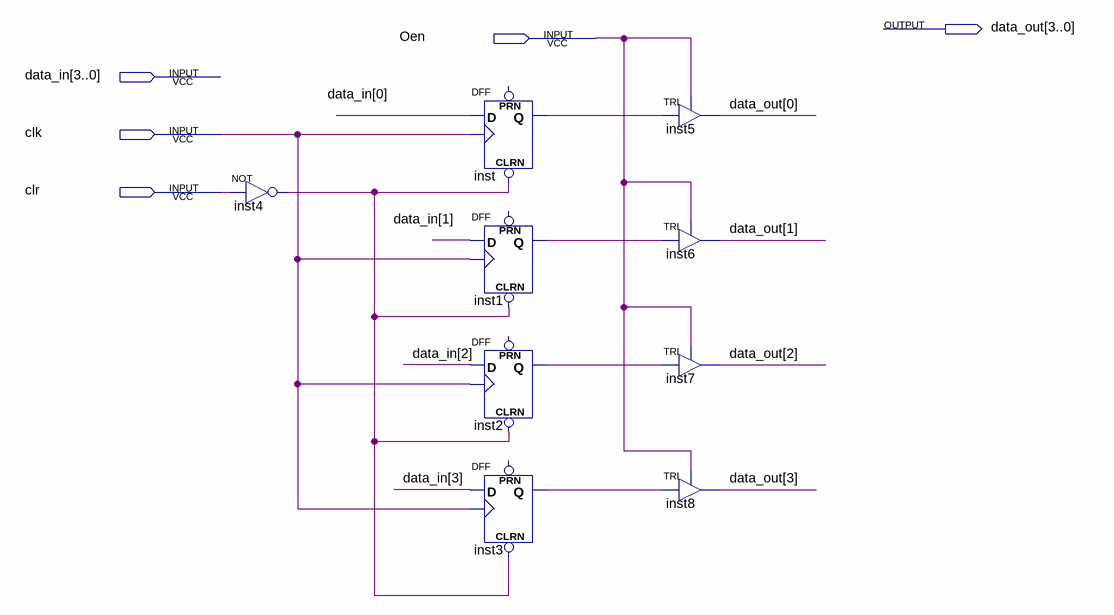
[diagram p0: schematic sheet]
// Quartus schematic Oen4bit.bdf as structural Verilog: 9 symbols, 5 pins
module Oen4bit (
  input  Oen,
  input  [3:0] data_in,
  input  clk,
  input  clr,
  output [3:0] data_out
);

  wire inst1_q, inst2_q, inst3_q, inst4_out, inst_q;

  not inst4 (inst4_out, clr);
  DFF inst (.CLRN(inst4_out), .CLK(clk), .D(data_in[0]), .Q(inst_q));  // open: PRN
  DFF inst1 (.CLRN(inst4_out), .CLK(clk), .D(data_in[1]), .Q(inst1_q));  // open: PRN
  DFF inst2 (.CLRN(inst4_out), .CLK(clk), .D(data_in[2]), .Q(inst2_q));  // open: PRN
  DFF inst3 (.CLRN(inst4_out), .CLK(clk), .D(data_in[3]), .Q(inst3_q));  // open: PRN
  TRI inst5 (.IN(inst_q), .OE(Oen), .OUT(data_out[0]));
  TRI inst6 (.IN(inst1_q), .OE(Oen), .OUT(data_out[1]));
  TRI inst7 (.IN(inst2_q), .OE(Oen), .OUT(data_out[2]));
  TRI inst8 (.IN(inst3_q), .OE(Oen), .OUT(data_out[3]));
endmodule
